# Altium schematic sheet Schametic Layout.SchDoc
size A0; SheetNumber: 1; SheetTotal: 1
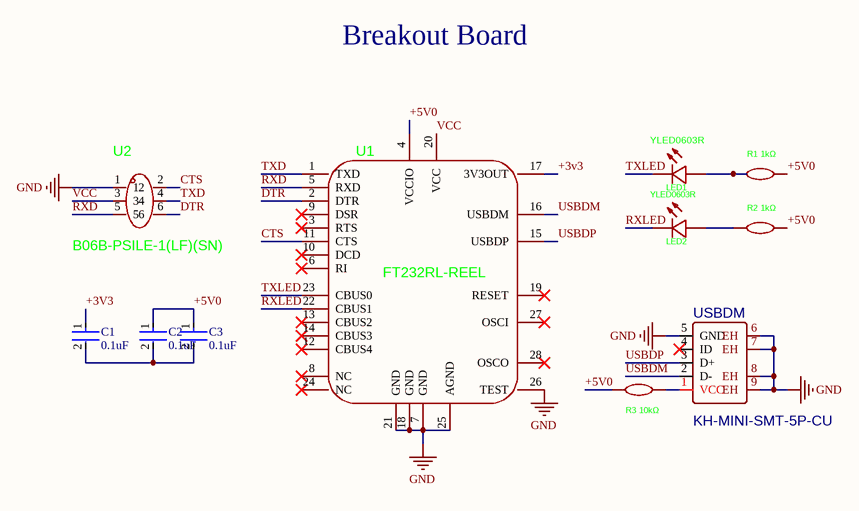
[diagram p0: Schametic Layout.SchDoc]

## Parts
C1  0.1uF  [FP-C0402-BB-IPC_B]
C2  0.1uF  [FP-C0402-BB-IPC_B]
C3  0.1uF  [FP-C0402-BB-IPC_B]
LED1  YLED0603R  [LED0603-FD]
LED2  YLED0603R  [LED0603-FD]
R1  1kΩ  [R0603]
R2  1kΩ  [R0603]
R3  10kΩ  [R0603]
U1  FT232RL-REEL  [SSOP-28_L10.2-W5.3-P0.65-LS7.8-BL]
U2  B06B-PSILE-1(LF)(SN)  [CONN-TH_6P-P4.00_JST_B06B-PSILE-1-LF-SN]
USBDM  KH-MINI-SMT-5P-CU  [MINI-USB-SMD_KH-MINI-SMT-5P-CU]

## Nets
GND: U1.7(GND) U1.18(GND) U1.21(GND) U1.25(AGND) U1.26(TEST) U2.1 USBDM.5(GND) USBDM.6(EH) USBDM.7(EH) USBDM.8(EH) USBDM.9(EH)
+3v3: C1.1 U1.17(3V3OUT)
+5V0: C2.1 C3.1 R1.2 R2.2 R3.1 U1.4(VCCIO)
CTS: U1.11(CTS) U2.2
DTR: U1.2(DTR) U2.6
RXD: U1.5(RXD) U2.5
RXLED: LED2.2(-) U1.22(CBUS1)
TXD: U1.1(TXD) U2.4
TXLED: LED1.2(-) U1.23(CBUS0)
USBDM: U1.16(USBDM) USBDM.2(D-)
USBDP: U1.15(USBDP) USBDM.3(D+)
VCC: U1.20(VCC) U2.3
NetC1_2: C1.2 C2.2 C3.2
NetLED1_1: LED1.1(+) R1.1
NetLED2_1: LED2.1(+) R2.1
NetR3_2: R3.2 USBDM.1(VCC)

Not connected (* = marked no-connect by the designer): U1 3(RTS)* 6(RI)* 8(NC)* 9(DSR)* 10(DCD)* 12(CBUS4)* 13(CBUS2)* 14(CBUS3)* 19(RESET)* 24(NC)* 27(OSCI)* 28(OSCO)*; USBDM 4(ID)*

## Notes on the sheet
- Breakout Board

## Library data of the parts
C1-C3 = CMP-2008-02046-2: CAP CER 0.1UF 10V X5R 0402; Manufacturer: Kemet; Manufacturer Part Number: C0402C104K8PACTU; Material: Ceramic; Capacitance: 0.10 μF; Temperature Coefficient: 15%; Tolerance: 0.1; Value: 0.10 μF; Package: C0402-BB; Temperature: -55°C to +125°C; ComponentLink2Description: Datasheet; Temperature Characteristic: X5R; Device Class L1: Passive Components; Height: 0.55mm; Lead Free: Yes; ComponentLink2URL: https://content.kemet.com/datasheets/KEM_C1002_X7R_SMD.pdf; Device Class L2: Capacitors; Temperature Range Low: -55°C; Temperature Range High: +125°C; RoHS: TRUE; Octopart: https://octopart.com/c0402c104k8pactu-kemet-140039; Automotive: No; Mouser Description: Capacitor 100 nF 10 VDC 0402 | KEMET C0402C104K8PACTU (Capacitor 100 nF 10 VDC 0402 Ceramic Capacitors).; Category: Cap; Voltage Rating: 10 V; Digikey Description: CAP CER 0.1UF 10V X5R 0402; Ipc Land Pattern Name: CAPC10050X50; Device Class L3: Ceramic Capacitors
LED1 LED2 = YLED0603R: Manufacturer: YONGYUTAI(永裕泰); Add into BOM: yes; Emitted Color: Red; Forward Voltage (VF): 1.8V~2.4V; Forward Current: 25mA; Dominant Wavelength: 620nm~625nm; Symbol: YLED0603R; Device: YLED0603R; LCSC Part Name: YLED0603R; Supplier Part: C19171390; Manufacturer Part: YLED0603R; Supplier Footprint: 0603; JLCPCB Part Class: Extended Part; Datasheet: https://atta.szlcsc.com/upload/public/pdf/source/20231027/FB19AF06E2C70028E58AB5CEDD1BDC72.pdf; Supplier: LCSC; Convert to PCB: yes; Power Dissipation: -; Peak Wavelength: -; Diode Configuration: -; Lens Color: -; Color Temperature: -; Luminous Intensity: -; Viewing Angle: -; Mounting Sytle: -; Operating Temperature: -40℃~+85℃
R1 R2 = RC0603FR-0710KL: Manufacturer: YAGEO(国巨); Add into BOM: yes; Value: 10kΩ; Tolerance: ±1%; Temperature Coefficient: ±100ppm/℃; Symbol: RC0603FR-0710KL; Device: RC0603FR-0710KL; LCSC Part Name: 厚膜电阻 10kΩ ±1% 100mW; Supplier Part: C98220; Manufacturer Part: RC0603FR-0710KL; Supplier Footprint: 0603; JLCPCB Part Class: Extended Part; Datasheet: https://atta.szlcsc.com/upload/public/pdf/source/20180927/C295883_E8D83085EA81BD7DE0B2B681138C15EE.pdf; Supplier: LCSC; Convert to PCB: yes; Type: Thick Film Resistors; Operating Temperature Range: -55℃~+155℃
R3 = RC0603FR-0710KL: Manufacturer: YAGEO(国巨); Add into BOM: yes; Tolerance: ±1%; Temperature Coefficient: ±100ppm/℃; Symbol: RC0603FR-0710KL; Device: RC0603FR-0710KL; LCSC Part Name: 厚膜电阻 10kΩ ±1% 100mW; Supplier Part: C98220; Manufacturer Part: RC0603FR-0710KL; Supplier Footprint: 0603; JLCPCB Part Class: Extended Part; Datasheet: https://atta.szlcsc.com/upload/public/pdf/source/20180927/C295883_E8D83085EA81BD7DE0B2B681138C15EE.pdf; Supplier: LCSC; Convert to PCB: yes; Type: Thick Film Resistors; Value: 10kΩ; Operating Temperature Range: -55℃~+155℃
U1 = FT232RL-REEL: Manufacturer: FTDI(飞特帝亚); Add into BOM: yes; Applications Function: USB to UART; Supply Voltage: 3.3V~5.25V; Symbol: FT232RL-REEL; Device: FT232RL-REEL; LCSC Part Name: FT232R USB UART 芯片; Supplier Part: C8690; Manufacturer Part: FT232RL-REEL; Supplier Footprint: SSOP-28-208mil; JLCPCB Part Class: Extended Part; Datasheet: https://atta.szlcsc.com/upload/public/pdf/source/20130221/1457706592200.pdf; Supplier: LCSC; Convert to PCB: yes; Operating Temperature: -40℃~+85℃
U2 = B06B-PSILE-1(LF)(SN): Manufacturer: JST; Add into BOM: yes; Symbol: B06B-PSILE-1(LF)(SN); Device: B06B-PSILE-1(LF)(SN); LCSC Part Name: B06B-PSILE-1(LF)(SN); Supplier Part: C5305924; Manufacturer Part: B06B-PSILE-1(LF)(SN); Supplier Footprint: -; JLCPCB Part Class: Extended Part; Datasheet: https://atta.szlcsc.com/upload/public/pdf/source/20220125/269FDD7CCCA7D6F7CD97DE92C25BFCB0.pdf; Supplier: LCSC; Convert to PCB: yes
USBDM = KH-MINI-SMT-5P-CU: Manufacturer: kinghelm(金航标); Contributor: LCSC; Supplier: LCSC; Supplier Part: C2688795; Manufacturer Part: KH-MINI-SMT-5P-Cu; JLCPCB Part Class: Extended Part; spicePre: U; spiceSymbolName: KH-MINI-SMT-5P-CU